# EAGLE board Motherboard (EAGLE 9.6.2), part 1 of 2
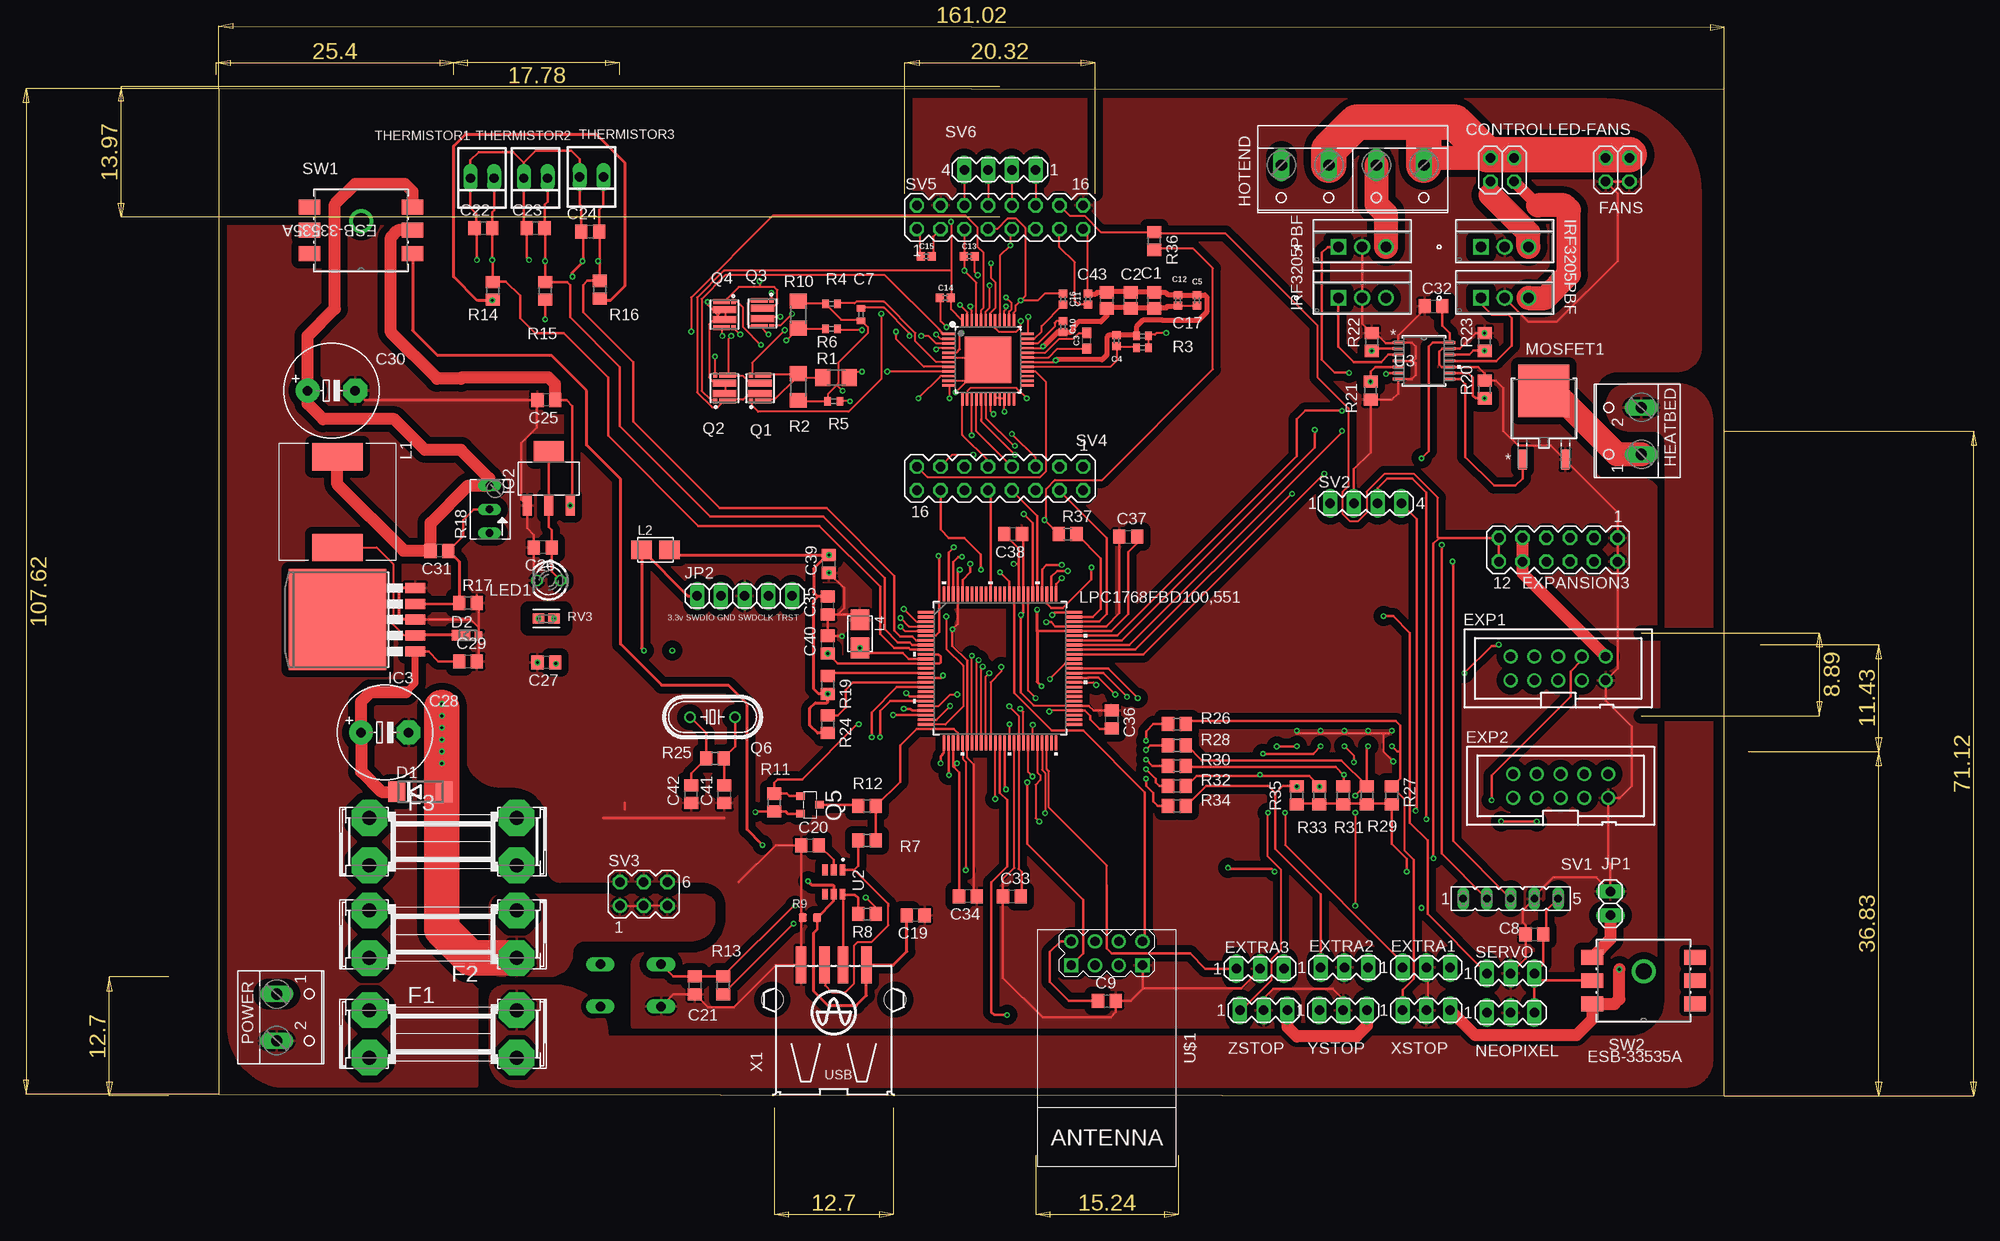
[diagram p3: board, top side]
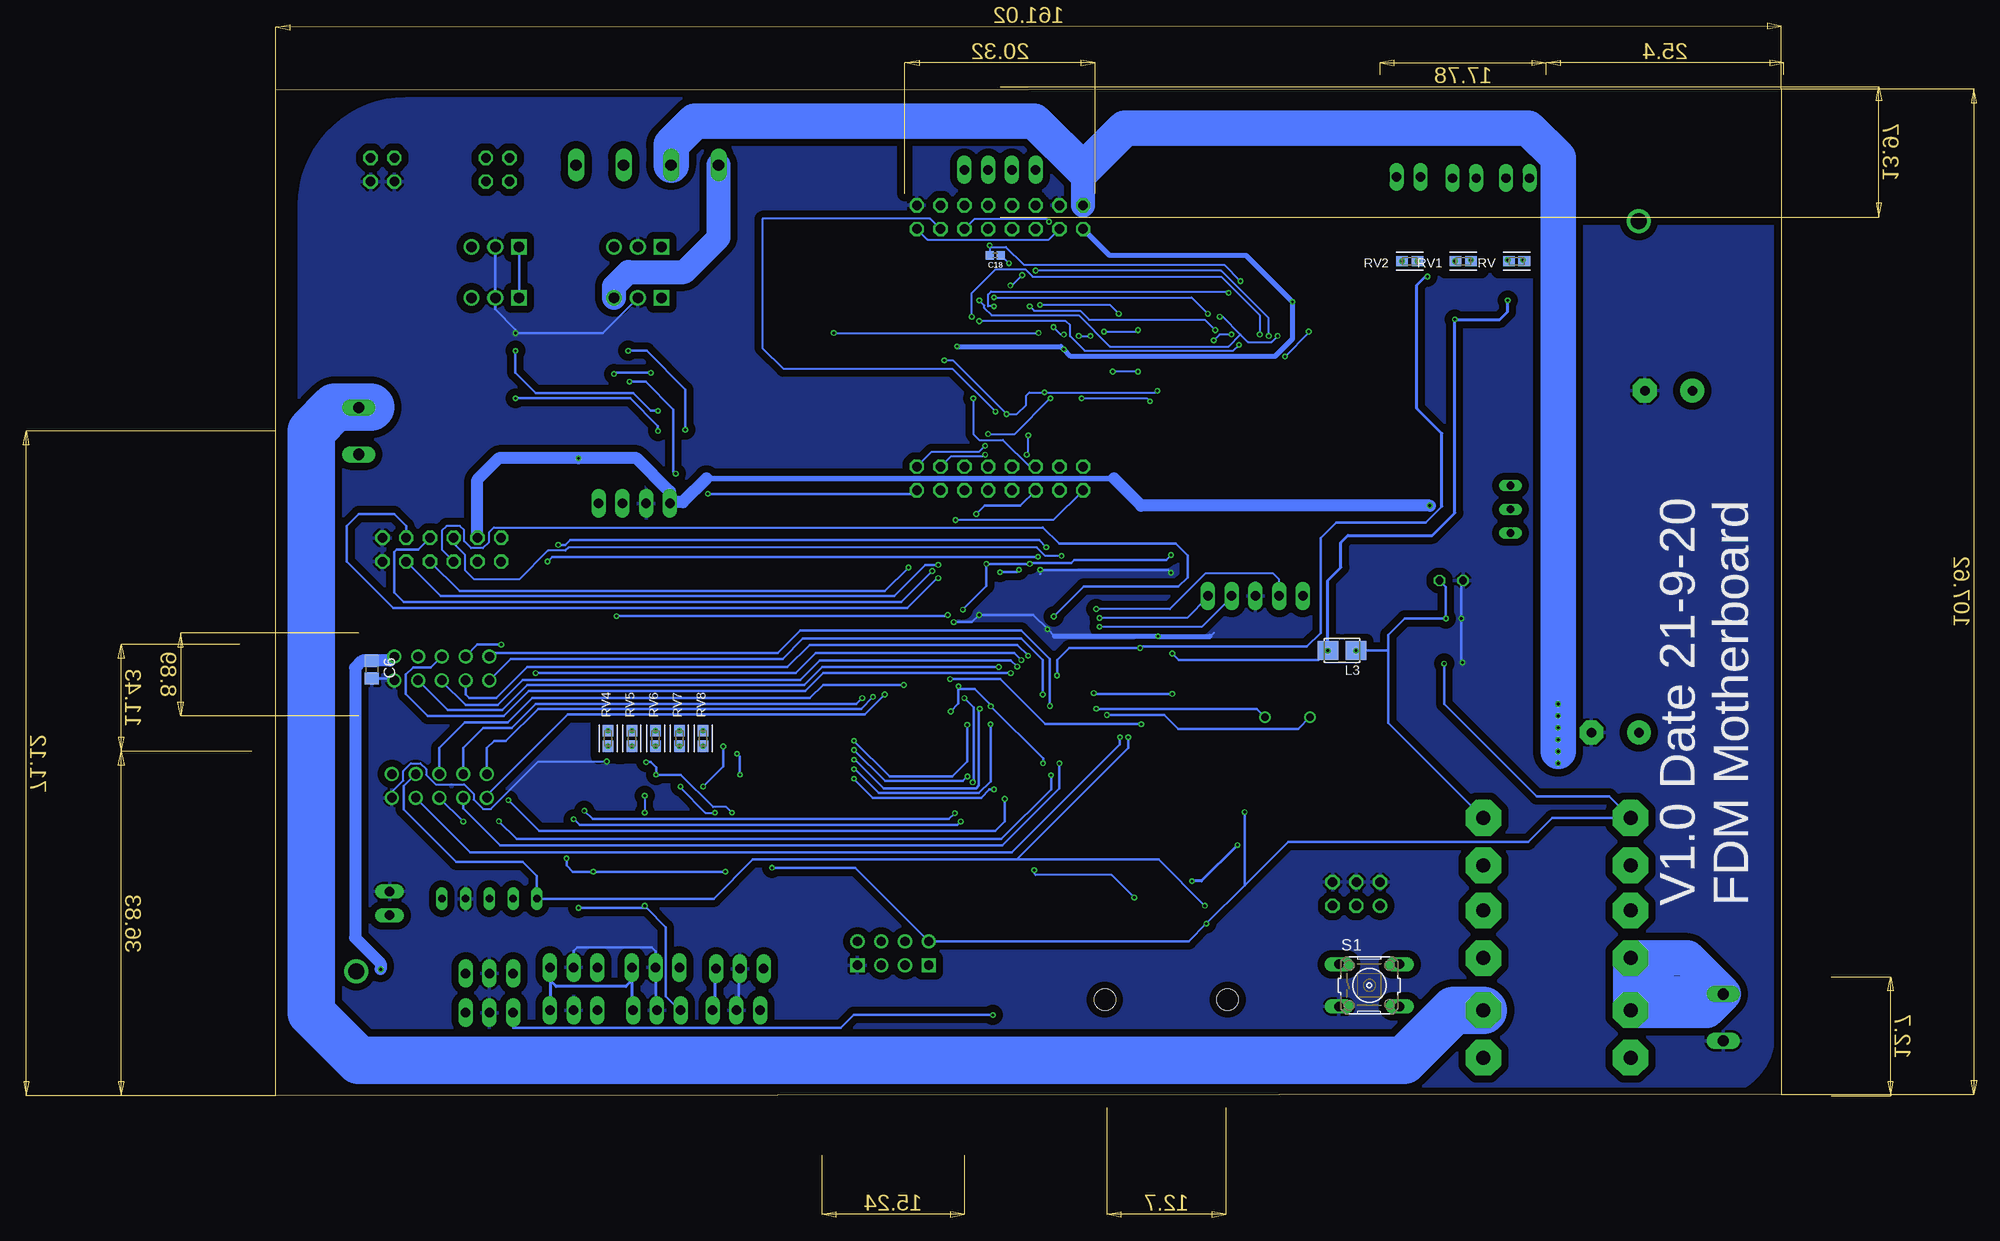
[diagram p4: board, bottom side, seen from below]

Size 161.02 x 107.75 mm. Coordinates in mm from the lower left corner, seen from the top.
Outline: 161.02,107.62 0,107.75 0,0.13 161.02,0 161.02,107.62
Copper layers (1*16): Top 0.035mm / dielectric 1.5mm / Bottom 0.035mm
Design rules "default *": minimum track width 8mil, minimum drill 0.3mm, track to track 8mil, track to pad 8mil, pad to pad 8mil, via to via 8mil, smd to smd 6mil, copper to edge 8mil, drill to drill 6mil, minimum pad ring 6mil, minimum via ring 6mil, stop-mask expansion 4mil, vias tented up to drill 0mil, thermal gap 10mil

## Footprints (pad centres in the part's own frame; a part is rotated, then mirrored left to right if it is on the bottom)
C0805 = smd 1.3 x 1.5: 1 -0.85,0; 2 0.85,0
0603 = smd 1.1 x 1: 1 -0.85,0; 2 0.85,0
0402 = smd 0.85 x 0.9: 1 -0.58,0; 2 0.58,0
C0805' = smd 1.3 x 1.5: 1 -0.95,0; 2 0.95,0
C0402 = smd 0.7 x 0.9: 1 -0.65,0; 2 0.65,0
E5-10,5 = drill 1.016 pad 2.54: + -2.54,0 | drill 1.016 pad 2.54 octagon: - 2.54,0
2X02 = drill 1.016 octagon: 1 -1.27,-1.27; 2 -1.27,1.27; 3 1.27,-1.27; 4 1.27,1.27
DO214AA = smd 1.8 x 2.2: A 2.55,0; C -2.55,0
POWERDI323 = smd 0.8 x 0.8: A 1.15,0 | smd 2 x 1.1: C -0.75,0
PAK100/2500-10 = drill 1 pad 1.422: 1 -5.08,-1.27; 2 -5.08,1.27; 3 -2.54,-1.27; 4 -2.54,1.27; 5 0,-1.27; 6 0,1.27; 7 2.54,-1.27; 8 2.54,1.27; 9 5.08,-1.27; 10 5.08,1.27
MA06-2 = drill 1.016 octagon: 1 -6.35,-1.27; 2 -6.35,1.27; 3 -3.81,-1.27; 4 -3.81,1.27; 5 -1.27,-1.27; 6 -1.27,1.27; 7 1.27,-1.27; 8 1.27,1.27; 9 3.81,-1.27; 10 3.81,1.27; 11 6.35,-1.27; 12 6.35,1.27
MA03-1 = drill 1.016 long: 1 -2.54,0; 2 0,0; 3 2.54,0
SHK20Q = drill 1.5 pad 3.81 octagon: 1A -7.874,2.54; 1B -7.874,-2.54; 2A 7.874,2.54; 2B 7.874,-2.54
W237-102 = drill 1.194 long: 1 -2.5,-1.27; 2 2.5,-1.27
W237-4P = drill 1.194 long: 1 -7.62,-0.635; 2 -2.54,-0.635; 3 2.54,-0.635; 4 7.62,-0.635
TQFP48-EP = smd 0.25 x 1.45: 1 -2.75,-4.175; 2 -2.25,-4.175; 3 -1.75,-4.175; 4 -1.25,-4.175; 5 -0.75,-4.175; 6 -0.25,-4.175; 7 0.25,-4.175; 8 0.75,-4.175; 9 1.25,-4.175; 10 1.75,-4.175; 11 2.25,-4.175; 12 2.75,-4.175; 25 2.75,4.175; 26 2.25,4.175; 27 1.75,4.175; 28 1.25,4.175; 29 0.75,4.175; 30 0.25,4.175; 31 -0.25,4.175; 32 -0.75,4.175; 33 -1.25,4.175; 34 -1.75,4.175; 35 -2.25,4.175; 36 -2.75,4.175 | smd 1.45 x 0.25: 13 4.175,-2.75; 14 4.175,-2.25; 15 4.175,-1.75; 16 4.175,-1.25; 17 4.175,-0.75; 18 4.175,-0.25; 19 4.175,0.25; 20 4.175,0.75; 21 4.175,1.25; 22 4.175,1.75; 23 4.175,2.25; 24 4.175,2.75; 37 -4.175,2.75; 38 -4.175,2.25; 39 -4.175,1.75; 40 -4.175,1.25; 41 -4.175,0.75; 42 -4.175,0.25; 43 -4.175,-0.25; 44 -4.175,-0.75; 45 -4.175,-1.25; 46 -4.175,-1.75; 47 -4.175,-2.25; 48 -4.175,-2.75 | smd 5 x 5: 49 0,0
SOT223 = smd 0.95 x 2.15: 1 -2.3,-2.9; 2 0,-2.9; 3 2.3,-2.9 | smd 3.25 x 2.15: 4 0,2.9
TO263-5 = smd 1.067 x 2.159: 1 -3.404,-5.791; 2 -1.702,-5.791; 3 0,-5.791; 4 1.702,-5.791; 5 3.404,-5.791 | smd 10.8 x 10.41: 6 0,2.54
1X02 = drill 1.016 long: 1 -1.27,0; 2 1.27,0
1X05 = drill 1.016 long: 1 -5.08,0; 2 -2.54,0; 3 0,0; 4 2.54,0; 5 5.08,0
INDP125125X600N = smd 2.9 x 5.4: 1 -4.85,0; 2 4.85,0
M1331 = smd 2.2 x 2: 1 -1.5,0; 2 1.5,0
LED3MM = drill 0.813 octagon: A -1.27,0; K 1.27,0
D-PAK_TO-252AA_INF-L = smd 0.889 x 2.184: 1 -2.29,-5.474; 3 2.29,-5.474 | smd 5.461 x 5.613: 2 0,1.854
TRANS_FDMC8030 = smd 0.52 x 0.45: 1 -1.39,0.975; 8 1.39,0.975 | smd 0.52 x 1.75: 4 -1.39,-0.325; 5 1.39,-0.325 | smd 0.75 x 2.52: 9 0.55,0; 10 -0.55,0
MICRO3 = smd 0.8 x 0.9: 1 -0.95,-1; 2 0.95,-1; 3 0,1
HC49/S = drill 0.813: 1 -2.413,0; 2 2.413,0
R1206 = smd 1.6 x 1.803: 1 -1.422,0; 2 1.422,0
R0402 = smd 0.7 x 0.9: 1 -0.65,0; 2 0.65,0
R0805 = smd 1.3 x 1.5: 1 -0.95,0; 2 0.95,0
R0603 = smd 0.889 x 0.889: 1 0,0.762; 2 0,-0.762
B64Y = drill 0.813 long: A 2.54,0; E -2.54,0; S 0,0
BOURNS_INC._CG0603MLC-3.3LE_1 = smd 1.255 x 1.106: 1 -0.826,0; 2 0.826,0
B3F-10XX = drill 1.016 long: 1 -3.251,2.261; 2 3.251,2.261; 3 -3.251,-2.261; 4 3.251,-2.261
FE05-1 = drill 0.813 long: 1 -5.08,0; 2 -2.54,0; 3 0,0; 4 2.54,0; 5 5.08,0
MA04-1 = drill 1.016 long: 1 -3.81,0; 2 -1.27,0; 3 1.27,0; 4 3.81,0
MA03-2 = drill 1.016: 1 -2.54,-1.27 | drill 1.016 octagon: 2 -2.54,1.27; 3 0,-1.27; 4 0,1.27; 5 2.54,-1.27; 6 2.54,1.27
MA08-2 = drill 1.016 octagon: 1 -8.89,-1.27; 2 -8.89,1.27; 3 -6.35,-1.27; 4 -6.35,1.27; 5 -3.81,-1.27; 6 -3.81,1.27; 7 -1.27,-1.27; 8 -1.27,1.27; 9 1.27,-1.27; 10 1.27,1.27; 11 3.81,-1.27; 12 3.81,1.27; 13 6.35,-1.27; 14 6.35,1.27; 15 8.89,-1.27; 16 8.89,1.27
ESB335_PAN = smd 2.311 x 1.6: 1 -5.5,2.5; 2 -5.5,0; 3 -5.5,-2.5; 4 5.5,-2.5; 5 5.5,0; 6 5.5,2.5 | drill 1.702 pad 2.21: 7 0,-0.991
22-23-2021 = drill 1 long: 1 -1.27,0; 2 1.27,0
LQFP100_14X14_NXP = smd 1.625 x 0.28: 1 -7.963,6; 2 -7.963,5.5; 3 -7.963,5; 4 -7.963,4.5; 5 -7.963,4; 6 -7.963,3.5; 7 -7.963,3; 8 -7.963,2.5; 9 -7.963,2; 10 -7.963,1.5; 11 -7.963,1; 12 -7.963,0.5; 13 -7.963,0; 14 -7.963,-0.5; 15 -7.963,-1; 16 -7.963,-1.5; 17 -7.963,-2; 18 -7.963,-2.5; 19 -7.963,-3; 20 -7.963,-3.5; 21 -7.963,-4; 22 -7.963,-4.5; 23 -7.963,-5; 24 -7.963,-5.5; 25 -7.963,-6; 51 7.963,-6; 52 7.963,-5.5; 53 7.963,-5; 54 7.963,-4.5; 55 7.963,-4; 56 7.963,-3.5; 57 7.963,-3; 58 7.963,-2.5; 59 7.963,-2; 60 7.963,-1.5; 61 7.963,-1; 62 7.963,-0.5; 63 7.963,0; 64 7.963,0.5; 65 7.963,1; 66 7.963,1.5; 67 7.963,2; 68 7.963,2.5; 69 7.963,3; 70 7.963,3.5; 71 7.963,4; 72 7.963,4.5; 73 7.963,5; 74 7.963,5.5; 75 7.963,6 | smd 0.28 x 1.625: 26 -6,-7.963; 27 -5.5,-7.963; 28 -5,-7.963; 29 -4.5,-7.963; 30 -4,-7.963; 31 -3.5,-7.963; 32 -3,-7.963; 33 -2.5,-7.963; 34 -2,-7.963; 35 -1.5,-7.963; 36 -1,-7.963; 37 -0.5,-7.963; 38 0,-7.963; 39 0.5,-7.963; 40 1,-7.963; 41 1.5,-7.963; 42 2,-7.963; 43 2.5,-7.963; 44 3,-7.963; 45 3.5,-7.963; 46 4,-7.963; 47 4.5,-7.963; 48 5,-7.963; 49 5.5,-7.963; 50 6,-7.963; 76 6,7.963; 77 5.5,7.963; 78 5,7.963; 79 4.5,7.963; 80 4,7.963; 81 3.5,7.963; 82 3,7.963; 83 2.5,7.963; 84 2,7.963; 85 1.5,7.963; 86 1,7.963; 87 0.5,7.963; 88 0,7.963; 89 -0.5,7.963; 90 -1,7.963; 91 -1.5,7.963; 92 -2,7.963; 93 -2.5,7.963; 94 -3,7.963; 95 -3.5,7.963; 96 -4,7.963; 97 -4.5,7.963; 98 -5,7.963; 99 -5.5,7.963; 100 -6,7.963
SOP95P275X110-6N = smd 1.15 x 0.6: 1 -1.3,0.95; 2 -1.3,0; 3 -1.3,-0.95; 4 1.3,-0.95; 5 1.3,0; 6 1.3,0.95
TSSOP14_4P50X5P10_ONS-L = smd 1.156 x 0.305: 1 -2.775,1.95; 2 -2.775,1.3; 3 -2.775,0.65; 4 -2.775,0; 5 -2.775,-0.65; 6 -2.775,-1.3; 7 -2.775,-1.95; 8 2.775,-1.95; 9 2.775,-1.3; 10 2.775,-0.65; 11 2.775,0; 12 2.775,0.65; 13 2.775,1.3; 14 2.775,1.95
PG-TO220-3_INF = drill 1.118 pad 1.626 square: 1 0,0 | drill 1.118 pad 1.626: 2 2.54,0; 3 5.08,0
WIRELESS-WIFI-ESP-01 = drill 1 square: A1 -8.89,3.81; D1 -8.89,-3.81 | drill 1: A2 -11.43,3.81; B1 -8.89,1.27; B2 -11.43,1.27; C1 -8.89,-1.27; C2 -11.43,-1.27; D2 -11.43,-3.81
USB-A003 = smd 1.12 x 4: 1 -3.5,14; 2 -1,14; 3 1,14; 4 3.5,14 | hole 2.3: -6.57,10.28; 6.57,10.28

## Placement (x,y rotation side)
C1  10uF  [C0805]  100.08,85.09 90 top
C2  10uF  [C0805]  97.54,85.09 90 top
C3  22nF  [0603]  92.84,80.77 90 top
C4  470nF  [0402]  96.01,80.77 270 top
C5  470nF  [0402]  104.65,85.09 90 top
C6  22UF  [C0805']  150.75,45.59 270 bottom
C7  2.2uF  [C0402]  68.71,83.57 90 top
C8  22UF  [C0805']  140.72,17.27 0 top
C9  22UF  [C0805']  95,10.16 0 top
C10  0.1uF  [0402]  90.3,82.3 270 top
C11  0.1uF  [0402]  92.96,85.22 90 top
C12  0.1uF  [0402]  102.62,85.09 90 top
C13  0.1uF  [0402]  80.26,89.79 0 top
C14  0.1uF  [0402]  77.72,85.34 0 top
C15  470nF  [0402]  75.69,89.79 0 top
C16  0.1uF  [0402]  90.3,85.22 270 top
C17  2.2uF  [C0402]  98.81,81.28 0 top
C18  0.1uF  [0402]  84.07,89.92 180 bottom
C19  0.1UF  [C0805']  74.55,19.3 180 top
C20  4700PF  [C0805']  63.25,26.8 0 top
C21  0.1UF  [C0805']  50.93,11.81 270 top
C22  22UF  [C0805']  28.32,92.84 0 top
C23  22UF  [C0805']  33.91,92.84 0 top
C24  22UF  [C0805']  39.75,92.46 0 top
C25  0.1UF  [C0805']  35.05,74.42 180 top
C26  10UF  [C0805']  34.67,58.67 180 top
C27  22UF  [C0805']  35.05,46.35 180 top
C28  220UF  [E5-10,5]  17.78,38.86 0 top
C29  100nF  [C0805']  26.67,46.48 0 top
C30  200UF  [E5-10,5]  12.06,75.44 0 top
C31  100nF  [C0805']  23.62,58.29 180 top
C32  0.1UF  [C0805']  129.92,84.45 0 top
C33  0.1UF  [C0805']  84.84,21.34 0 top
C34  0.1UF  [C0805']  80.14,21.34 180 top
C35  0.1UF  [C0805']  65.15,52.45 90 top
C36  0.1UF  [C0805']  95.5,40.26 270 top
C37  0.1UF  [C0805']  97.28,59.82 0 top
C38  0.1UF  [C0805']  84.96,60.07 180 top
C39  0.1UF  [C0805']  65.28,56.9 90 top
C40  0.1UF  [C0805']  65.15,48.26 90 top
C41  18PF  [C0805']  54.1,32.26 90 top
C42  18PF  [C0805']  50.55,32.26 90 top
C43  10uF  [C0805]  95,85.09 90 top
CONTROLLED-FANS  [2X02]  137.29,99.06 180 top
D1  [DO214AA]  21.59,32.51 0 top
D2  PD3S160  [POWERDI323]  26.67,49.28 0 top
EXP1  2510-  [PAK100/2500-10]  143.26,45.72 0 top
EXP2  2510-  [PAK100/2500-10]  143.51,33.15 0 top
EXPANSION3  [MA06-2]  143.26,58.42 180 top
EXTRA1  [MA03-1]  129.16,13.72 0 top
EXTRA2  [MA03-1]  120.4,13.72 0 top
EXTRA3  [MA03-1]  111.38,13.59 0 top
F1  20A  [SHK20Q]  24,6.6 0 top
F2  10A  [SHK20Q]  24,17.27 180 top
F3  7.5A  [SHK20Q]  24,27.18 0 top
FANS  [2X02]  149.61,99.06 180 top
HEATBED  [W237-102]  150.88,71.12 90 top
HOTEND  [W237-4P]  121.28,98.93 180 top
IC1  TMC5160-TA  [TQFP48-EP]  82.3,78.74 270 top
IC2  LM1117MP-3.3  [SOT223]  35.31,66.04 0 top
IC3  LM2596S  [TO263-5]  15.24,50.93 90 top
JP1  [1X02]  148.84,20.57 270 top
JP2  swd  [1X05]  56.26,53.47 0 top
L1  SRR1260-331K  [INDP125125X600N]  12.7,63.5 270 top
L2  FB-M1331  [M1331]  46.74,58.42 0 top
L3  FB-M1331  [M1331]  46.99,47.62 180 bottom
L4  FB-M1331  [M1331]  68.58,49.4 270 top
LED1  TLLR4400  [LED3MM]  35.31,55.12 180 top
MOSFET1  IRLR8743PBFD-PAK_TO-252AA_INF-L  [D-PAK_TO-252AA_INF-L]  141.73,73.53 0 top
NEOPIXEL  [MA03-1]  138.18,8.89 0 top
POWER  [W237-102]  7.49,8.38 270 top
Q1  FDMC8030  [TRANS_FDMC8030]  57.91,75.69 90 top
Q2  FDMC8030  [TRANS_FDMC8030]  54.1,75.69 90 top
Q3  FDMC8030  [TRANS_FDMC8030]  58.17,83.69 270 top
Q4  FDMC8030  [TRANS_FDMC8030]  54.1,83.57 270 top
Q5  IRLML5203  [MICRO3]  63.25,31.12 270 top
Q6  120MHZ  [HC49/S]  52.83,40.51 180 top
R1  0.075  [R1206]  66.04,76.83 180 top
R2  0.075  [R1206]  61.98,75.82 270 top
R3  2.2  [R0402]  98.81,80.01 0 top
R4  47  [R0402]  65.53,84.71 0 top
R5  47  [R0402]  65.79,74.3 0 top
R6  47  [R0402]  65.53,82.04 180 top
R7  27  [R0805]  69.34,27.3 180 top
R8  27  [R0805]  69.34,19.43 180 top
R9  SMD-RES-VARISTOR-5V-28V(0603)  [R0603]  63.25,19.05 270 top
R10  0.075  [R1206]  61.98,83.57 90 top
R11  1.5K  [R0805]  59.44,31.37 270 top
R12  1.5K  [R0805]  69.34,30.99 180 top
R13  4.7K  [R0805]  53.98,11.81 90 top
R14  4.7K  [R0805]  29.34,86.11 90 top
R15  4.7K  [R0805]  34.93,86.11 90 top
R16  4.7K  [R0805]  40.77,86.23 90 top
R17  330  [R0805]  26.67,52.7 0 top
R18  10k  [B64Y]  28.96,62.74 90 top
R19  10k  [R0805]  65.15,43.94 270 top
R20  10k  [R0805]  135.38,75.56 90 top
R21  10k  [R0805]  123.19,75.44 270 top
R22  10k  [R0805]  123.32,80.64 90 top
R23  10k  [R0805]  135.38,80.64 90 top
R24  10k  [R0805]  65.15,39.75 270 top
R25  1M  [R0805]  53.09,36.07 0 top
R26  1k  [R0805]  102.49,39.75 180 top
R27  10K  [R0805]  125.48,32.13 270 top
R28  1k  [R0805]  102.49,37.46 180 top
R29  10K  [R0805]  122.81,32.13 270 top
R30  1k  [R0805]  102.49,35.31 180 top
R31  10K  [R0805]  120.27,32.13 270 top
R32  1k  [R0805]  102.49,33.15 180 top
R33  10K  [R0805]  117.73,32.13 270 top
R34  1k  [R0805]  102.49,30.99 180 top
R35  10K  [R0805]  115.32,32.13 270 top
R36  10k  [R0805]  100.08,91.44 270 top
R37  100  [R0805]  90.81,60.07 0 top
RV  BOURNS_INC._CG0603MLC-3.3LEBOURNS_INC._CG0603MLC-3.3LE_0_1  [BOURNS_INC._CG0603MLC-3.3LE_1]  28.32,89.28 180 bottom
RV1  BOURNS_INC._CG0603MLC-3.3LEBOURNS_INC._CG0603MLC-3.3LE_0_1  [BOURNS_INC._CG0603MLC-3.3LE_1]  34.04,89.28 180 bottom
RV2  BOURNS_INC._CG0603MLC-3.3LEBOURNS_INC._CG0603MLC-3.3LE_0_1  [BOURNS_INC._CG0603MLC-3.3LE_1]  39.75,89.28 180 bottom
RV3  BOURNS_INC._CG0603MLC-3.3LEBOURNS_INC._CG0603MLC-3.3LE_0_1  [BOURNS_INC._CG0603MLC-3.3LE_1]  35.05,51.05 0 top
RV4  BOURNS_INC._CG0603MLC-3.3LEBOURNS_INC._CG0603MLC-3.3LE_0_1  [BOURNS_INC._CG0603MLC-3.3LE_1]  125.48,38.23 90 bottom
RV5  BOURNS_INC._CG0603MLC-3.3LEBOURNS_INC._CG0603MLC-3.3LE_0_1  [BOURNS_INC._CG0603MLC-3.3LE_1]  122.94,38.23 90 bottom
RV6  BOURNS_INC._CG0603MLC-3.3LEBOURNS_INC._CG0603MLC-3.3LE_0_1  [BOURNS_INC._CG0603MLC-3.3LE_1]  120.4,38.23 90 bottom
RV7  BOURNS_INC._CG0603MLC-3.3LEBOURNS_INC._CG0603MLC-3.3LE_0_1  [BOURNS_INC._CG0603MLC-3.3LE_1]  117.86,38.23 90 bottom
RV8  BOURNS_INC._CG0603MLC-3.3LEBOURNS_INC._CG0603MLC-3.3LE_0_1  [BOURNS_INC._CG0603MLC-3.3LE_1]  115.32,38.23 90 bottom
S1  [B3F-10XX]  44.07,11.81 0 bottom
SERVO  [MA03-1]  138.18,13.08 0 top
SV1  [FE05-1]  138.18,21.08 0 top
SV2  [MA04-1]  122.68,63.37 0 top
SV3  [MA03-2]  45.47,21.59 0 top
SV4  [MA08-2]  83.57,66.04 180 top
SV5  [MA08-2]  83.57,93.98 0 top
SV6  [MA04-1]  83.57,99.06 180 top
SW1  ESB-33535A  [ESB335_PAN]  15.24,92.58 180 top
SW2  ESB-33535A  [ESB335_PAN]  152.4,12.32 180 top
THERMISTOR1  22-23-2021  [22-23-2021]  28.19,98.17 180 top
THERMISTOR2  22-23-2021  [22-23-2021]  33.91,98.17 180 top
THERMISTOR3  22-23-2021  [22-23-2021]  39.88,98.3 180 top
U1  LPC1768FBD100,551  [LQFP100_14X14_NXP]  83.57,45.72 0 top
U2  NUP2114UCMR6T1G  [SOP95P275X110-6N]  65.79,22.86 270 top
U3  MC74HCT125ADTR2GTSSOP14_4P50X5P10_ONS-L  [TSSOP14_4P50X5P10_ONS-L]  128.91,78.61 0 top
U4  IRF3205PBF  [PG-TO220-3_INF]  119.76,85.34 0 top
U5  IRF3205PBF  [PG-TO220-3_INF]  119.76,90.8 0 top
U6  IRF3205PBF  [PG-TO220-3_INF]  135,90.8 0 top
U7  IRF3205PBF  [PG-TO220-3_INF]  135,85.34 0 top
U$1  WIRELESS-WIFI-ESP-01  [WIRELESS-WIFI-ESP-01]  95,5.08 270 top
X1  [USB-A003]  65.79,0 0 top
XSTOP  [MA03-1]  129.16,9.14 0 top
YSTOP  [MA03-1]  120.27,9.14 0 top
ZSTOP  [MA03-1]  111.76,9.14 0 top